# EAGLE schematic 3PDT Board (EAGLE 8.4.1)
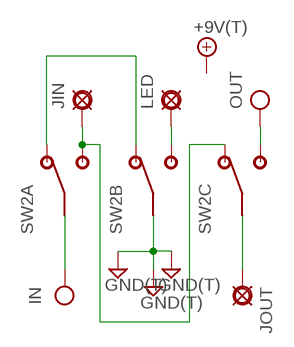
[diagram p0: schematic, sheet 1]

## Parts
+9V  +9V(T)  [SQUARE]
G  GND(T)  [SQUARE]
IN  IN(T)  [SQUARE]
JIG  GND(T)  [SQUARE]
JIN  PAD  [SQUARE]
JOG  GND(T)  [SQUARE]
JOUT  PAD  [SQUARE]
LED  PAD  [SQUARE]
OUT  OUT(T)  [SQUARE]
SW2  3PDT  [3PDT]

## Nets
GND: G.1(GND) JIG.1(GND) JOG.1(GND) SW2.B2
IN: IN.1(IN) SW2.A2
N$1: LED.1(PAD) SW2.B3
N$2: JOUT.1(PAD) SW2.C2
N$3: SW2.A1 SW2.B1
N$4: JIN.1(PAD) SW2.A3 SW2.C1
OUT: OUT.1(OUT) SW2.C3
Unconnected: +9V.1(+9V)

## Library data of the parts
+9V = mb_supply:+9V(T): +9V Voltage Supply use this to hook up +9v throughout a schematic instead of running wire automatically labels the net "+9v" adds a hookup pad to the circuit board
G JIG JOG = mb_supply:GND(T): Ground use this to hook up ground (GND) throughout a schematic instead of running wire automatically labels the net "GND" adds a hookup pad to the circuit board (you can use several)
IN = mb_supply:IN(T): Input obsolete: use Pad instead and label net shematic input label with circuit board terminal/pad generally used only once on a schematic (because this device labels the net "IN" in the same way as a voltage supply or ground net)
JIN JOUT LED = mb_supply:PAD: PAD use this package for pads with any purpose, including input, output, send or return various pad shapes: round, square, octogonal, long, and long offset
OUT = mb_supply:OUT(T): Output obsolete: use Pad instead and label net output label with circuit board terminal/pad usually appears only once on a schematic
SW2 = mb_switches:3PDT